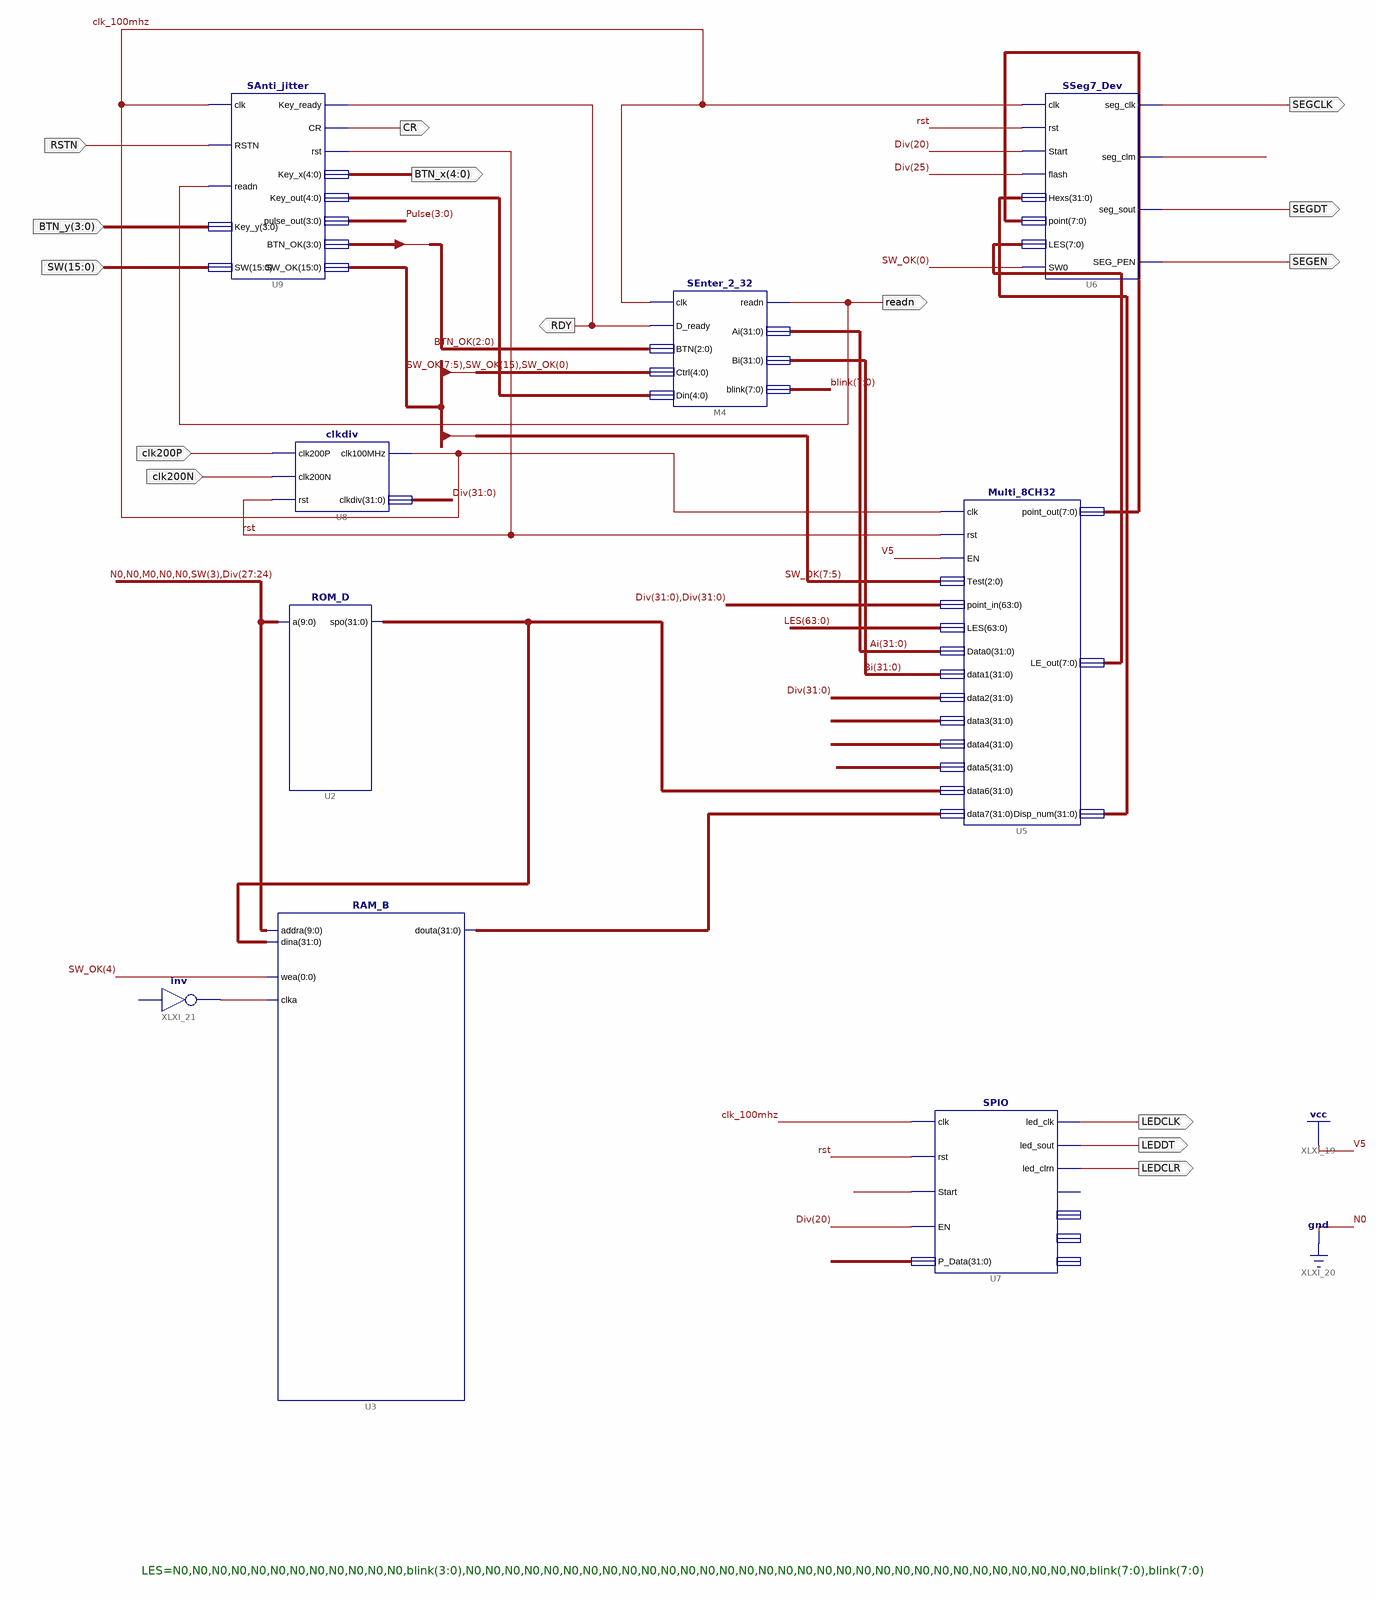
[diagram p0: schematic sheet 1]
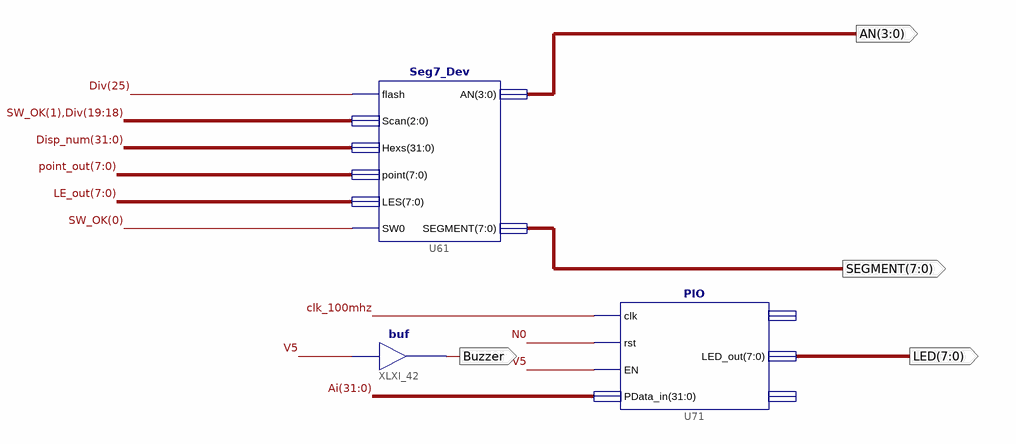
[diagram p1: schematic sheet 2]
// Xilinx ISE schematic Sseg7.sch (kintex7) as structural Verilog: 12 symbols, 19 ports
module Sseg7 (
  input  clk200P,
  input  clk200N,
  input  RSTN,
  input  [3:0] BTN_y,
  input  [15:0] SW,
  output LEDCLK,
  output LEDDT,
  output LEDCLR,
  output readn,
  output RDY,
  output CR,
  output [4:0] BTN_x,
  output [3:0] AN,
  output [7:0] SEGMENT,
  output Buzzer,
  output [7:0] LED,
  output SEGEN,
  output SEGDT,
  output SEGCLK
);

  wire clk_100mhz, M0, rst, XLXN_3, XLXN_6, XLXN_28;
  wire [3:0] BTN_OK, Pulse;
  wire [4:0] XLXN_93;
  wire [7:0] blink, LE_out, point_out, XLXN_39, XLXN_40;
  wire [15:0] SW_OK;
  wire [31:0] Ai, Bi, Disp_num, Div, XLXN_8, XLXN_38, XLXN_43, XLXN_45, XLXN_69, XLXN_70, XLXN_71;
  wire [63:0] LES;

  SEnter_2_32 M4 (
    .clk(clk_100mhz), .D_ready(RDY), .BTN(BTN_OK[2:0]), .Ctrl({SW_OK[7:5], SW_OK[15], SW_OK[0]}),
    .Din(XLXN_93), .readn(readn), .Ai(Ai), .Bi(Bi), .blink(blink));
  // inv XLXI_21 has open pins: I=open, O=XLXN_3
  RAM_B U3 (
    .addra({2'b00, M0, 2'b00, SW[3], Div[27:24]}), .dina(XLXN_43), .wea(SW_OK[4]), .clka(XLXN_3),
    .douta(XLXN_45));
  SPIO U7 (
    .clk(clk_100mhz), .rst(rst), .Start(XLXN_6), .EN(Div[20]), .P_Data(XLXN_8), .led_clk(LEDCLK),
    .led_sout(LEDDT), .led_clrn(LEDCLR));  // open: LED_PEN, counter_set, LED_out, GPIOf0
  ROM_D U2 (.a({2'b00, M0, 2'b00, SW[3], Div[27:24]}), .spo(XLXN_43));
  SAnti_jitter U9 (
    .clk(clk_100mhz), .RSTN(RSTN), .readn(readn), .Key_y(BTN_y), .SW(SW), .Key_ready(RDY), .CR(CR),
    .rst(rst), .Key_x(BTN_x), .Key_out(XLXN_93), .pulse_out(Pulse), .BTN_OK(BTN_OK), .SW_OK(SW_OK));
  Multi_8CH32 U5 (
    .clk(clk_100mhz), .rst(rst), .EN(1'b1), .Test(SW_OK[7:5]), .point_in({Div, Div}), .LES(LES), .Data0(Ai),
    .data1(Bi), .data2(Div), .data3(XLXN_71), .data4(XLXN_70), .data5(XLXN_69), .data6(XLXN_43),
    .data7(XLXN_45), .point_out(XLXN_39), .LE_out(XLXN_40), .Disp_num(XLXN_38));
  SSeg7_Dev U6 (
    .clk(clk_100mhz), .rst(rst), .Start(Div[20]), .flash(Div[25]), .Hexs(XLXN_38), .point(XLXN_39),
    .LES(XLXN_40), .SW0(SW_OK[0]), .seg_clk(SEGCLK), .seg_clm(XLXN_28), .seg_sout(SEGDT), .SEG_PEN(SEGEN));
  clkdiv U8 (.clk200P(clk200P), .clk200N(clk200N), .rst(rst), .clk100MHz(clk_100mhz), .clkdiv(Div));
  PIO U71 (.clk(clk_100mhz), .rst(1'b0), .EN(1'b1), .PData_in(Ai), .LED_out(LED));  // open: counter_set, GPIOf0
  buf XLXI_42 (Buzzer, 1'b1);
  Seg7_Dev U61 (
    .flash(Div[25]), .Scan({SW_OK[1], Div[19:18]}), .Hexs(Disp_num), .point(point_out), .LES(LE_out),
    .SW0(SW_OK[0]), .AN(AN), .SEGMENT(SEGMENT));

  // Notes on the sheet:
  //   LES=N0,N0,N0,N0,N0,N0,N0,N0,N0,N0,N0,N0,blink(3:0),N0,N0,N0,N0,N0,N0,N0,N0,N0,N0,N0,N0,N0,N0,N0,N0,N0,N0,N0,N0,N0,N0,N0,N0,N0,N0,N0,N0,N0,N0,N0,N0,blink(7:0),blink(7:0)
endmodule
